# Altium schematic sheet InputOutputPower.SchDoc
size A4; SheetNumber: 2; SheetTotal: 4
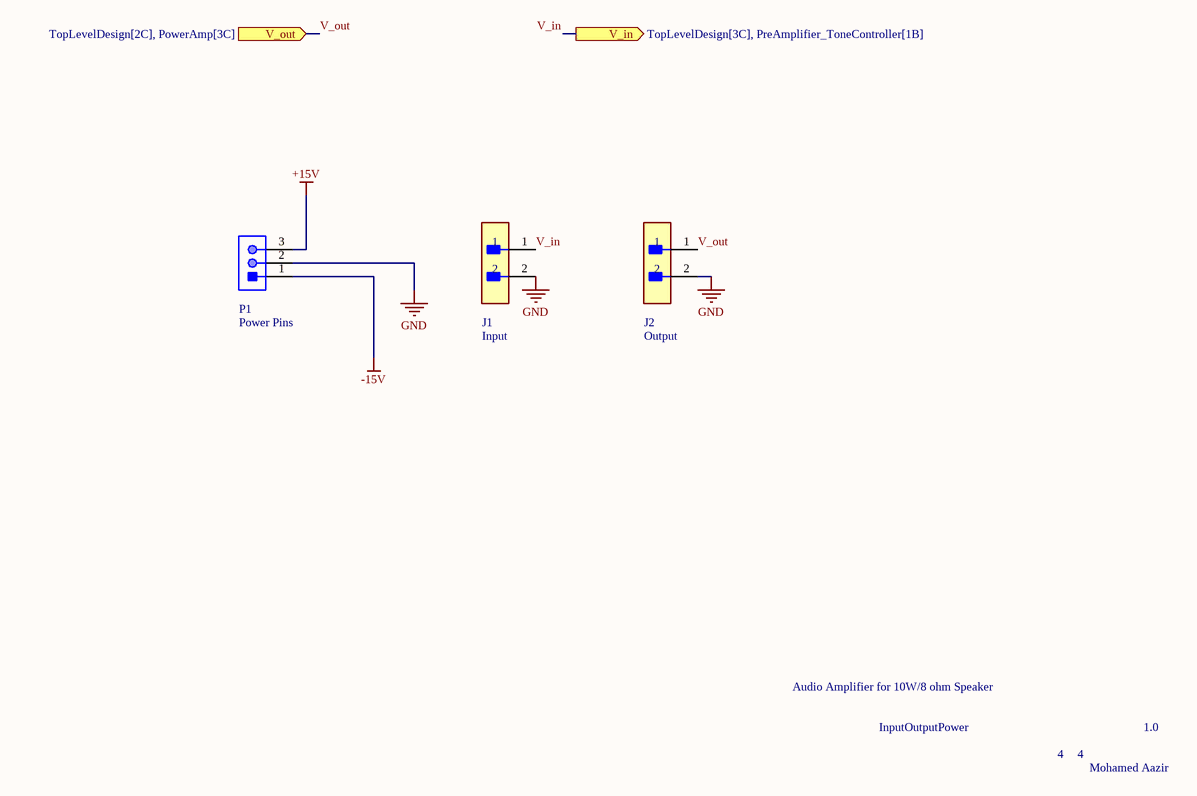
[diagram p0: InputOutputPower.SchDoc]

## Parts
J1  Input  [FP-B2B-EH-A_LF_SN-MFG]
J2  Output  [FP-B2B-EH-A_LF_SN-MFG]
P1  Power Pins  [JST-B3B-PH-K-S-3_V]

## Ports
V_in (out, see TopLevelDesign[3C], PreAmplifier_ToneController[1B]), V_out (in, see TopLevelDesign[2C], PowerAmp[3C])

## Nets
+15V: P1.3
-15V: P1.1
GND: J1.2 J2.2 P1.2
V_in: J1.1 ; port V_in
V_out: J2.1 ; port V_out

## Notes on the sheet
- Audio Amplifier for 10W/8 ohm Speaker
- InputOutputPower
- 4
- 1.0
- Mohamed Aazir

## Library data of the parts
J1 J2 = CMP-17439-000026-1: CONN HEADER VERT 2POS 2.5MM; Number of Contacts: 2; Current Rating: 3A; Connector Type: Plug; Contact Resistance: 20mR; Gender: Male; Voltage Rating: 250V; Fastening Type: Detent; Depth: 3.8mm; Max Operating Temperature: 85°C; Orientation: Straight; Series: EH; Contact Plating: Tin; Min Operating Temperature: -25°C; Contact Type: Male Pin; Housing Color: White; Termination: Press-Fit; Housing Material: Nylon; Pitch: 2.5mm; Number of Positions: 2; Max Current Rating: 3A; Packaging: Bulk; Lead Free: Lead Free; Number of Rows: 1; Length: 7.5mm; Contact Mating Length: 0.13inch; Color: Natural; Max Voltage Rating (AC): 250V; Contact Material: Copper Alloy; Mount: Through Hole
P1 = CMP-2000-05164-1: Male Header, Pitch 2 mm, 1 x 3 Position, Height 6 mm, Tail Length 3.4 mm, -25 to 85 degC, RoHS, Bulk; Manufacturer: JST; Style/Orientation: StraightHeader/Plug; Pitch: 2mm; No of Positions: 3; Termination: Crimp; Manufacturer URL: http://www.jst.com/home2.html; Datasheet Version: Oct-06; Type: ShroudedHeader; Datasheet URL: https://datasheet.ciiva.com/11746/0900766b80826550-11746939.pdf